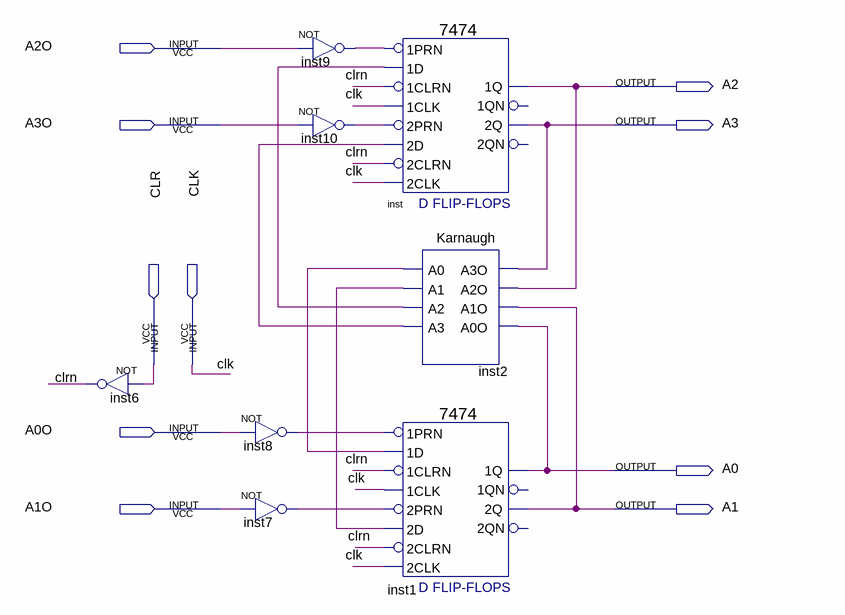
[diagram p0: schematic sheet]
// Quartus schematic Question1.bdf as structural Verilog: 8 symbols, 10 pins
module Question1 (
  input  A2O,
  input  A3O,
  input  CLR,
  input  CLK,
  input  A0O,
  input  A1O,
  output A2,
  output A3,
  output A0,
  output A1
);

  wire clrn, inst2_a0, inst2_a1, inst2_a2, inst2_a3, inst7_out, inst8_out, inst9_out, inst10_out;

  not inst6 (clrn, CLR);
  not inst8 (inst8_out, A0O);
  not inst7 (inst7_out, A1O);
  not inst9 (inst9_out, A2O);
  not inst10 (inst10_out, A3O);
  \7474  inst (
    .\2D (inst2_a3), .\2PRN (inst10_out), .\1CLK (CLK), .\1D (inst2_a2), .\1PRN (inst9_out), .\2CLK (CLK),
    .\2CLRN (clrn), .\1CLRN (clrn), .\2Q (A3), .\1Q (A2));  // open: 1QN, 2QN
  \7474  inst1 (
    .\2D (inst2_a1), .\2PRN (inst7_out), .\1CLK (CLK), .\1D (inst2_a0), .\1PRN (inst8_out), .\2CLK (CLK),
    .\2CLRN (clrn), .\1CLRN (clrn), .\2Q (A1), .\1Q (A0));  // open: 1QN, 2QN
  Karnaugh inst2 (.A3O(A3), .A2O(A2), .A1O(A1), .A0O(A0), .A0(inst2_a0), .A1(inst2_a1), .A2(inst2_a2), .A3(inst2_a3));
endmodule
